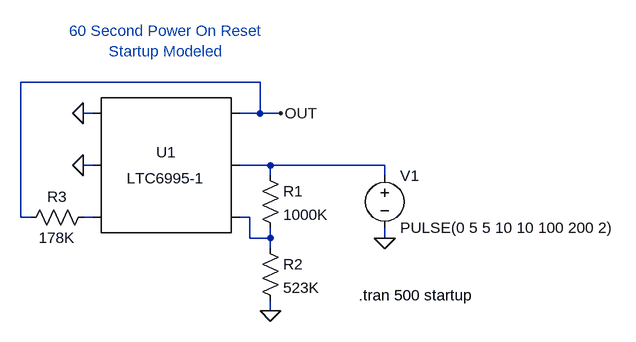
[diagram p0: schematic 6995-1.asc]
6995-1.asc, the LTspice schematic file:
Version 4
SHEET 1 996 680
WIRE 368 48 0 48
WIRE 112 96 96 96
WIRE 368 96 368 48
WIRE 368 96 336 96
WIRE 400 96 368 96
WIRE 112 176 96 176
WIRE 384 176 336 176
WIRE 560 176 384 176
WIRE 384 192 384 176
WIRE 560 192 560 176
WIRE 0 256 0 48
WIRE 16 256 0 256
WIRE 112 256 96 256
WIRE 352 256 336 256
WIRE 352 288 352 256
WIRE 384 288 384 272
WIRE 384 288 352 288
WIRE 560 288 560 272
WIRE 384 304 384 288
WIRE 384 400 384 384
FLAG 96 176 0
FLAG 400 96 OUT
FLAG 560 288 0
FLAG 384 400 0
FLAG 96 96 0
SYMBOL res 368 176 R0
SYMATTR InstName R1
SYMATTR Value 1000K
SYMBOL res 368 288 R0
SYMATTR InstName R2
SYMATTR Value 523K
SYMBOL res 112 240 R90
WINDOW 0 0 56 VBottom 2
WINDOW 3 32 56 VTop 2
SYMATTR InstName R3
SYMATTR Value 178K
SYMBOL voltage 560 176 R0
WINDOW 123 0 0 Left 2
WINDOW 39 0 0 Left 2
SYMATTR InstName V1
SYMATTR Value PULSE(0 5 5 10 10 100 200 2)
SYMBOL SpecialFunctions\\LTC6995-1 224 176 R0
SYMATTR InstName U1
TEXT 224 16 Bottom 2 ;60 Second Power On Reset\nStartup Modeled
TEXT 520 376 Left 2 !.tran 500 startup

The netlist it stands for:
* 6995-1.asc
R1 N001 N003 1000K
R2 N003 0 523K
R3 N002 OUT 178K
V1 N001 0 PULSE(0 5 5 10 10 100 200 2)
XU1 0 0 N002 N003 N001 OUT LTC6995-1
* 60 Second Power On Reset
* Startup Modeled
.tran 500 startup
.lib LTC6995-1.sub
.backanno
.end